# EAGLE design TH_itsy_bitsy_reference_board (EAGLE 9.5.2)
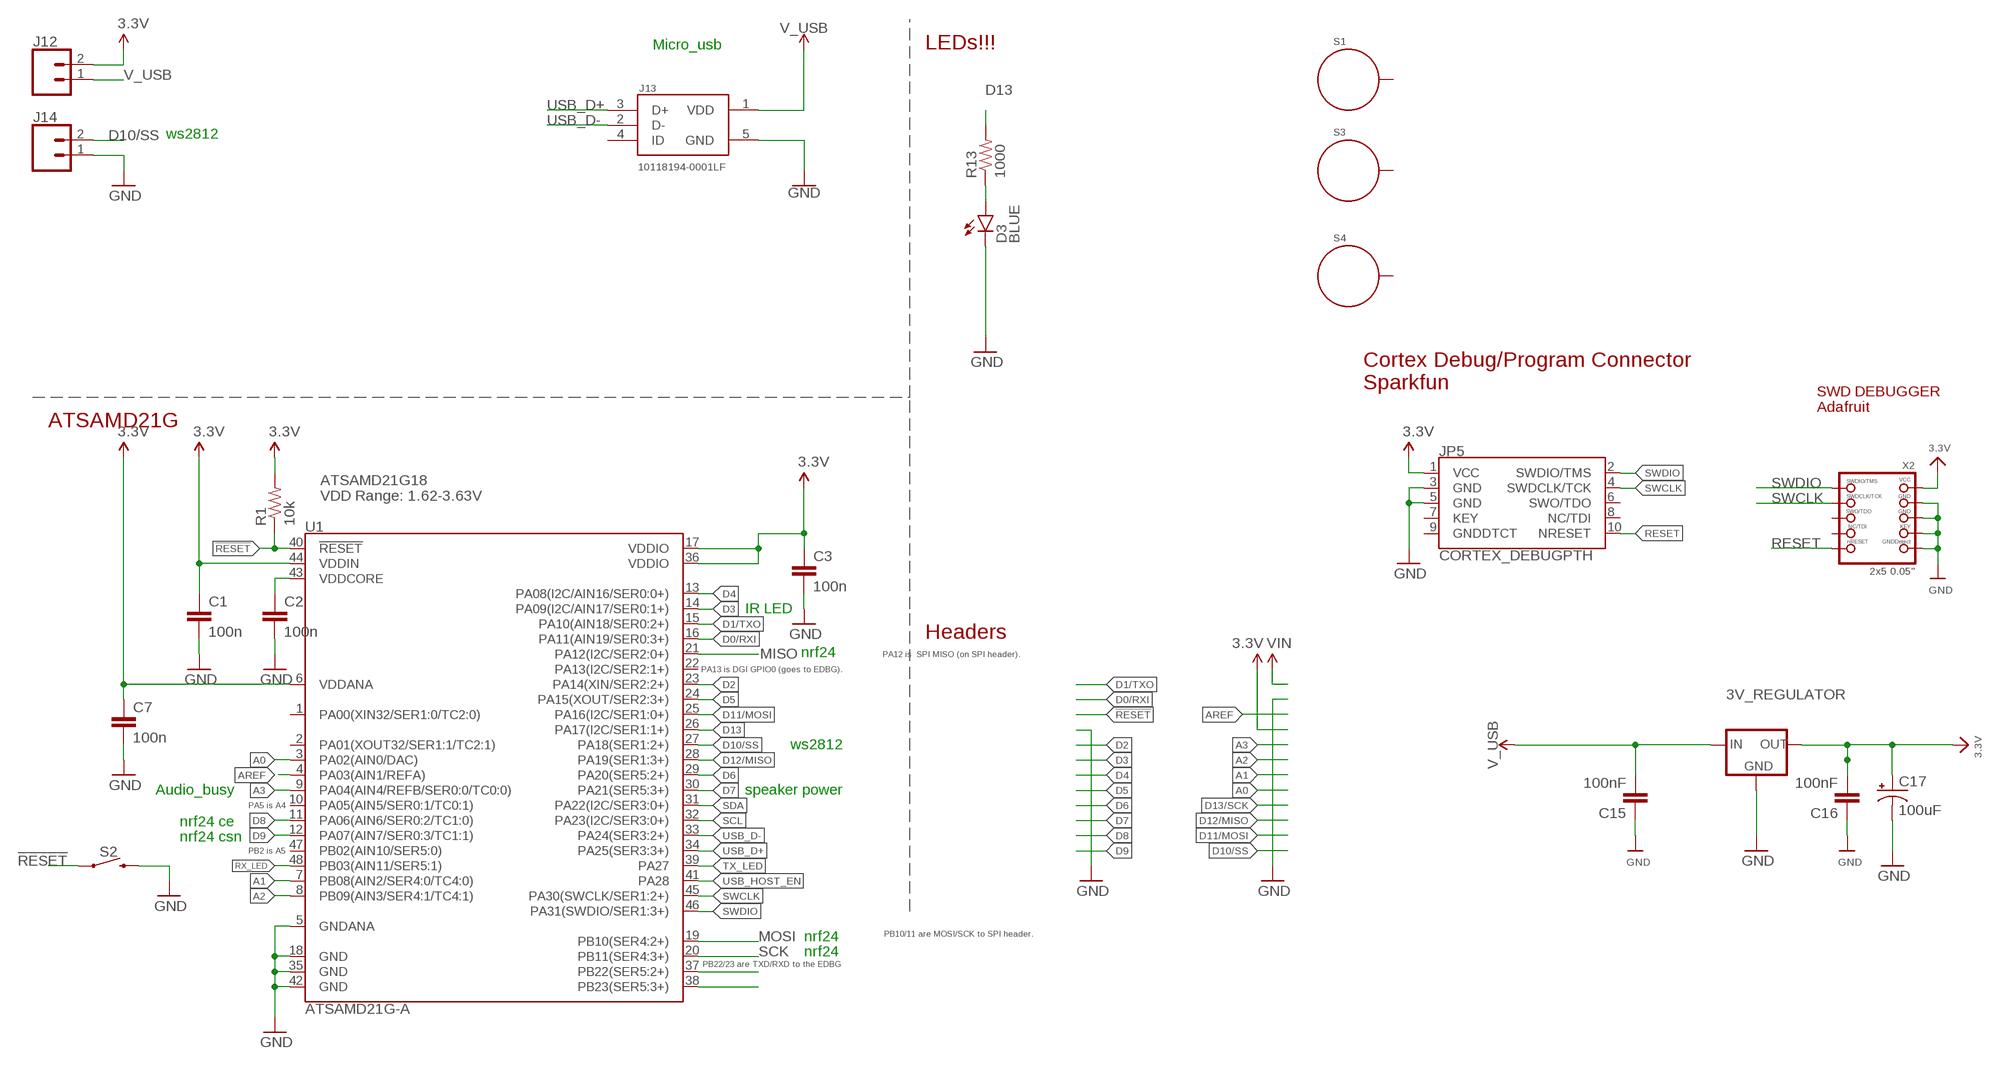
[diagram p0: schematic, sheet 1]

## Parts
3V_REGULATOR  LDL1117_5V_REG  [SOT223]
C1  100n  CAP0805  [0805]
C2  100n  CAP0805  [0805]
C3  100n  CAP0805  [0805]
C7  100n  CAP0805  [0805]
C15  100nF  10UF-0805-10V-10%  [0805]
C16  100nF  10UF-0805-10V-10%  [0805]
C17  100uF  100UF-POLAR-RADIAL-2.5MM-25V-20%  [CPOL-RADIAL-2.5MM-6.5MM]
D3  BLUE  LED-BLUE1206  [LED-1206]
J12  CONN_025MM  [SCREWTERMINAL-5MM-2]
J13  10118194-0001LF  [FRAMATOME_10118194-0001LF]
J14  CONN_025MM  [SCREWTERMINAL-5MM-2]
JP5  CORTEX_DEBUGPTH  [2X5-PTH-1.27MM]
R1  10k  RESISTOR0805-RES  [0805]
R13  1000  RESISTOR0805-RES  [0805]
S1  STANDOFF_ELECTRICAL144  [STANDOFF_ELECTRICAL_144MILL_NORMAL_SCREW]
S2  MOMENTARY-SWITCH-SPST-PTH-6.0MM-KIT  [TACTILE_SWITCH_PTH_6.0MM_KIT]
S3  STANDOFF_ELECTRICAL144  [STANDOFF_ELECTRICAL_144MILL_NORMAL_SCREW]
S4  STANDOFF_ELECTRICAL144  [STANDOFF_ELECTRICAL_144MILL_NORMAL_SCREW]
U1  ATSAMD21G-A  [TQFP-48]
X2  2x5 0.05"  JTAG-CORTEXBOXPOSTS  [2X05_1.27MM_BOX_POSTS]

## Nets
3.3V: 3V_REGULATOR.2(OUT) 3V_REGULATOR.4(OUT) C1.1 C3.1 C7.1 C16.2 C17.1(+) J12.2 JP5.1(VCC) R1.2 U1.6(VDDANA) U1.17(VDDIO) U1.36(VDDIO) U1.44(VDDIN) X2.1(VCC)
!RESET: R1.1 S2.1 U1.40(!RESET!)
A0: U1.3(PA02(AIN0/DAC))
A1: U1.7(PB08(AIN2/SER4:0/TC4:0))
A2: U1.8(PB09(AIN3/SER4:1/TC4:1))
A3: U1.9(PA04(AIN4/REFB/SER0:0/TC0:0))
AREF: U1.4(PA03(AIN1/REFA))
D0/RXI: U1.16(PA11(AIN19/SER0:3+))
D1/TXO: U1.15(PA10(AIN18/SER0:2+))
D2: U1.23(PA14(XIN/SER2:2+))
D3: U1.14(PA09(I2C/AIN17/SER0:1+))
D4: U1.13(PA08(I2C/AIN16/SER0:0+))
D5: U1.24(PA15(XOUT/SER2:3+))
D6: U1.29(PA20(SER5:2+))
D7: U1.30(PA21(SER5:3+))
D8: U1.11(PA06(AIN6/SER0:2/TC1:0))
D9: U1.12(PA07(AIN7/SER0:3/TC1:1))
D10/SS: J14.2 U1.27(PA18(SER1:2+))
D11/MOSI: U1.25(PA16(I2C/SER1:0+))
D12/MISO: U1.28(PA19(SER1:3+))
D13: R13.2 U1.26(PA17(I2C/SER1:1+))
GND: 3V_REGULATOR.1(GND) C1.2 C2.2 C3.2 C7.2 C15.1 C16.1 C17.2(-) D3.C J13.5(GND) J14.1 JP5.3(GND) JP5.5(GND) S2.3 U1.5(GNDANA) U1.18(GND) U1.35(GND) U1.42(GND) X2.3(GND) X2.5(GND) X2.7(KEY) X2.9(GNDDETECT)
INT1: U1.38(PB23(SER5:3+))
MISO: U1.21(PA12(I2C/SER2:0+))
MOSI: U1.19(PB10(SER4:2+))
N$2: U1.37(PB22(SER5:2+))
N$6: D3.A R13.1
RESET: JP5.10(NRESET) X2.10(NRESET)
RX_LED: U1.48(PB03(AIN11/SER5:1))
SCK: U1.20(PB11(SER4:3+))
SCL: U1.32(PA23(I2C/SER3:0+))
SDA: U1.31(PA22(I2C/SER3:0+))
SWCLK: JP5.4(SWDCLK/TCK) U1.45(PA30(SWCLK/SER1:2+)) X2.4(SWDCLK)
SWDIO: JP5.2(SWDIO/TMS) U1.46(PA31(SWDIO/SER1:3+)) X2.2(SWDIO)
TX_LED: U1.39(PA27)
USB_D+: J13.3(D+) U1.34(PA25(SER3:3+))
USB_D-: J13.2(D-) U1.33(PA24(SER3:2+))
USB_HOST_EN: U1.41(PA28)
V_USB: 3V_REGULATOR.3(IN) C15.2 J12.1 J13.1(VDD)
VDDCORE: C2.1 U1.43(VDDCORE)
Unconnected: J13.4(ID) JP5.6(SWO/TDO) JP5.7(KEY) JP5.8(NC/TDI) JP5.9(GNDDTCT) S1.P1 S3.P1 S4.P1 U1.1(PA00(XIN32/SER1:0/TC2:0)) U1.2(PA01(XOUT32/SER1:1/TC2:1)) U1.10(PA05(AIN5/SER0:1/TC0:1)) U1.22(PA13(I2C/SER2:1+)) U1.47(PB02(AIN10/SER5:0)) X2.6(SWO) X2.8(TDI)

## Notes on the sheet
- LEDs!!!
- Micro_usb
- ws2812
- Cortex Debug/Program Connector
  Sparkfun
- ATSAMD21G
- SWD DEBUGGER
  Adafruit
- ATSAMD21G18
  VDD Range: 1.62-3.63V
- IR LED
- Headers
- PA12 is  SPI MISO (on SPI header).
- nrf24
- PA13 is DGI GPIO0 (goes to EDBG).
- ws2812
- Audio_busy | speaker power
- PA5 is A4
- nrf24 ce
- nrf24 csn
- PB2 is A5
- PB10/11 are MOSI/SCK to SPI header.
- nrf24
- nrf24
- PB22/23 are TXD/RXD to the EDBG

## Library data of the parts
3V_REGULATOR = th_libraries_2:LDL1117_5V_REG: STMicroelectronics LDL1117S50R https://www.mouser.com/datasheet/2/389/ldl1117-1156241.pdf Mouser#: 511-LDL1117S50R bought 100 for $18 on ~2/3/18 5V, 1.2amp
C1-C3 C7 = SparkFun:CAP: Capacitor Standard 0603 ceramic capacitor, and 0.1" leaded capacitor.
C15 C16 = SparkFun-Capacitors:10UF: 10.0µF ceramic capacitors A capacitor is a passive two-terminal electrical component used to store electrical energy temporarily in an electric field.; PROD_ID: CAP-11330; VALUE: 10uF
C17 = SparkFun-Capacitors:100UF-POLAR: 100µF polarized capacitors A capacitor is a passive two-terminal electrical component used to store electrical energy temporarily in an electric field.; PROD_ID: CAP-08439
D3 = SparkFun-LED:LED-BLUE: Blue LEDs for production use Various blue LEDs stocked by SparkFun production 0603 - DIO-08575 Rebel - DIO-09553 1206 - DIO-09911; PROD_ID: DIO-09911
J12 J14 = SparkFun-Connectors:CONN_02: Multi connection point. Often used as Generic Header-pin footprint for 0.1 inch spaced/style header connections On any of the 0.1 inch spaced packages, you can populate with these: Break Away Headers - Straight <https://www.sparkfun.com/products/116> (PRT-00116) Break Away Male Headers - Right Angle <https://www.sparkfun.com/products/553> (PRT-00553) Female Headers <https://www.sparkfun.com/products/115> (PRT-00115) Break Away Headers - Machine Pin <https://www.sparkfun.com/products/117> (PRT-00117) Break Away Female Headers - Swiss Machine Pin <https://www.sparkfun.com/products/743> (PRT-00743) For SCREWTERMINALS and SPRING TERMINALS visit here: Screw Terimnals on SparkFun.com <https://www.sparkfun.com/search/results?term=Screw+Terminals> (5mm/3.5mm/2.54mm spacing) This device is also useful as a general connection point to wire up your design to another part of your project. Our various solder wires solder well into these plated through hole pads. Hook-Up Wire - Assortment (Stranded, 22 AWG) <https://www.sparkfun.com/products/11375> (PRT-11375) Hook-Up Wire - Assortment (Solid Core, 22 AWG) <https://www.sparkfun.com/products/11367> (PRT-11367) View the entire wire category on our website here <https://www.sparkfun.com/categories/141> Special notes: Molex polarized connector foot print use with: PRT-08233 with associated crimp pins and housings. 2.54_SCREWTERM for use with PRT-10571. 3.5mm Screw Terminal footprints for PRT-08084 5mm Screw Terminal footprints for use with PRT-08432; SF_SKU: PRT-08432
J13 = 10118194-0001LF:10118194-0001LF: Conn Micro USB Type B RCP 5 POS 0.65mm Solder RA SMD 5 Terminal 1 Port T/R; AVAILABILITY: Unavailable; DESCRIPTION: Micro Usb, 2.0 Type b, Rcpt, Smt; MF: Amphenol ICC; MP: 10118194-0001LF; PACKAGE: None; PRICE: None
JP5 = samd21-temp:CORTEX_DEBUG: Cortex Debug Connector Datasheet <http://infocenter.arm.com/help/topic/com.arm.doc.faqs/attached/13634/cortex_debug_connectors.pdf>
R1 = SparkFun:RESISTOR: Resistor Basic schematic elements and footprints for 0603, 1206, and PTH resistors.
R13 = SparkFun-Passives:RESISTOR: Resistor Basic schematic elements and footprints for 0603, 1206, and PTH resistors.
S1 S3 S4 = th_libraries:STANDOFF_ELECTRICAL: A standoff intended to be an electrically connected point. Pad size and stop size allow for a #8 Phillips pan screw head to make a solid connection to the board. Added 144mill drill hole that fits my normal wood screw
S2 = SparkFun-Switches:MOMENTARY-SWITCH-SPST: Momentary Switch (Pushbutton) - SPST Normally-open (NO) SPST momentary switches (buttons, pushbuttons). Variants PTH-12MM - 12mm square, through-hole Momentary Pushbutton Switch - 12mm Square <https://www.sparkfun.com/products/9190> (COM-09190) PTH-6.0MM, PTH-6.0MM-KIT - 6.0mm square, through-hole Mini Pushbutton Switch <https://www.sparkfun.com/products/97> (COM-00097) KIT package intended for soldering kit's - only one side of pads' copper is exposed. PTH-RIGHT-ANGLE-KIT - Right-angle, through-hole Right Angle Tactile Button <https://www.sparkfun.com/products/10791> - Used on SparkFun BigTime Watch Kit <https://www.sparkfun.com/products/11734> SMD-12MM - 12mm square, surface-mount Tactile Button - SMD (12mm) <https://www.sparkfun.com/products/12993> (COM-12993) Used on SparkFun PicoBoard <https://www.sparkfun.com/products/11888> SMD-4.5MM - 4.5mm Square Trackball Switch Used on SparkFun Blackberry Trackballer Breakout <https://www.sparkfun.com/products/13169> SMD-4.6MMX2.8MM - 4.60mm x 2.80mm, surface mount Used on SparkFun SAMD21 Mini Breakout <https://www.sparkfun.com/products/13664> SMD-5.2MM, SMD-5.2-REDUNDANT - 5.2mm square, surface-mount Mini Pushbutton Switch - SMD <https://www.sparkfun.com/products/8720> (COM-08720) Used on Arduino Pro Mini <https://www.sparkfun.com/products/11114> REDUNDANT package connects both switch circuits together SMD-6.0X3.5MM - 6.0 x 3.5mm, surface mount Momentary Reset Switch SMD <https://www.sparkfun.com/products/8229> (COM-08229) SMD-6.2MM-TALL - 6.2mm square, surface mount Tactile Button - SMD (6mm) <https://www.sparkfun.com/products/12992> Used on SparkFun Digital Sandbox <https://www.sparkfun.com/products/12651> SMD-RIGHT-ANGLE - Right-angle, surface mount Used on SparkFun Block for Intel® Edison - Arduino <https://www.sparkfun.com/products/13036>; PROD_ID: SWCH-08441; SF_SKU: COM-00097
U1 = samd21-temp:ATSAMD21G: Atmel SAMD21G SMART ARM-Based Microcontroller The Atmel ® | SMART ™ SAM D21 is a series of low-power microcontrollers using the 32-bit ARM ® Cortex ® -M0+ processor, and ranging from 32- to 64-pins with up to 256KB Flash and 32KB of SRAM. The SAM D21 devices operate at a maximum frequency of 48MHz and reach 2.46 CoreMark/MHz. They are designed for simple and intuitive migration with identical peripheral modules, hex compatible code, identical linear address map and pin compatible migration paths between all devices in the product series. All devices include intelligent and flexible peripherals, Atmel Event System for inter-peripheral signaling, and support for capacitive touch button, slider and wheel user interfaces.; PROD_ID: IC-13064
X2 = microbuilder:JTAG-CORTEX: Serial Wire (SW-DP) Connector Standard 0.05" 10-pin connector is for use with the Cortex M and Cortex A SWD (serial wire debugger) interface (SW-DP) Connectors 2x05_1.27MM_SMT - Inexpensive surface-mount header with bare pins, compatible with standard 10-pin SWD cables (4UCON: 16846) 2x05_1.27MM_BOX_NOPOSTS - Polarised surface-mount box (4UCON with caps: 19735, without caps: 15117 2x05_1.27MM_BOX_POSTS - Polarised surface-mount box with mounting holes (4UCON: 20317) Pinout: http://infocenter.arm.com/help/topic/com.arm.doc.faqs/attached/13634/cortex_debug_connectors.pdf http://www.keil.com/peripherals/coresight/connectors.asp

## Net classes
1 power: width 0.254 mm

## Board
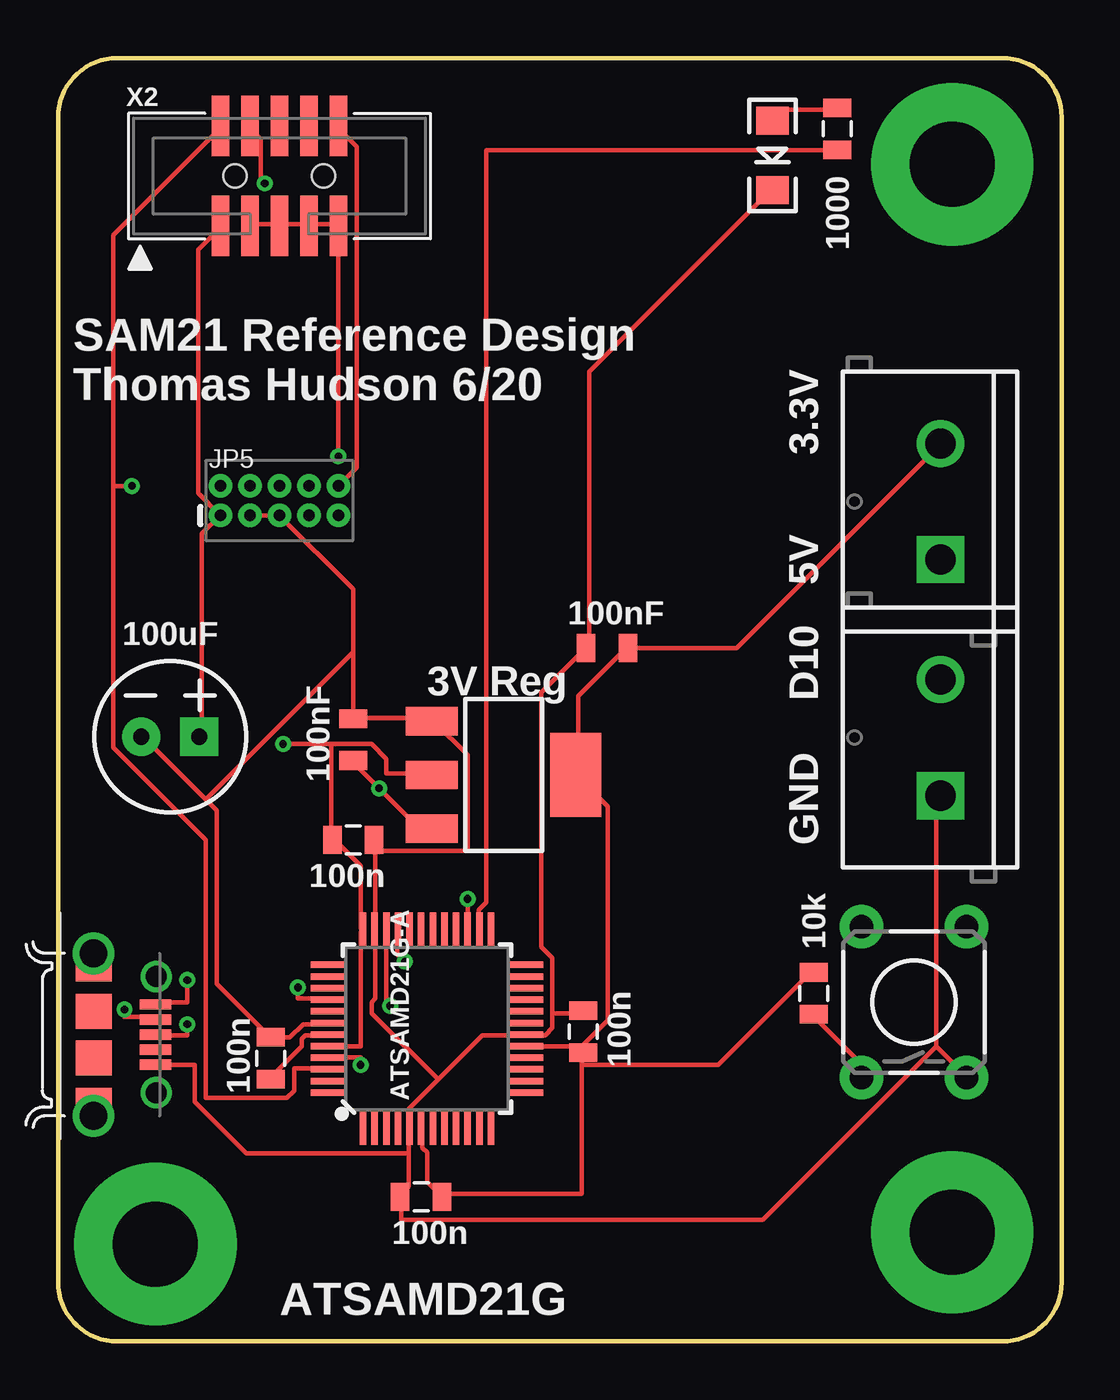
[diagram p1: board, top side]
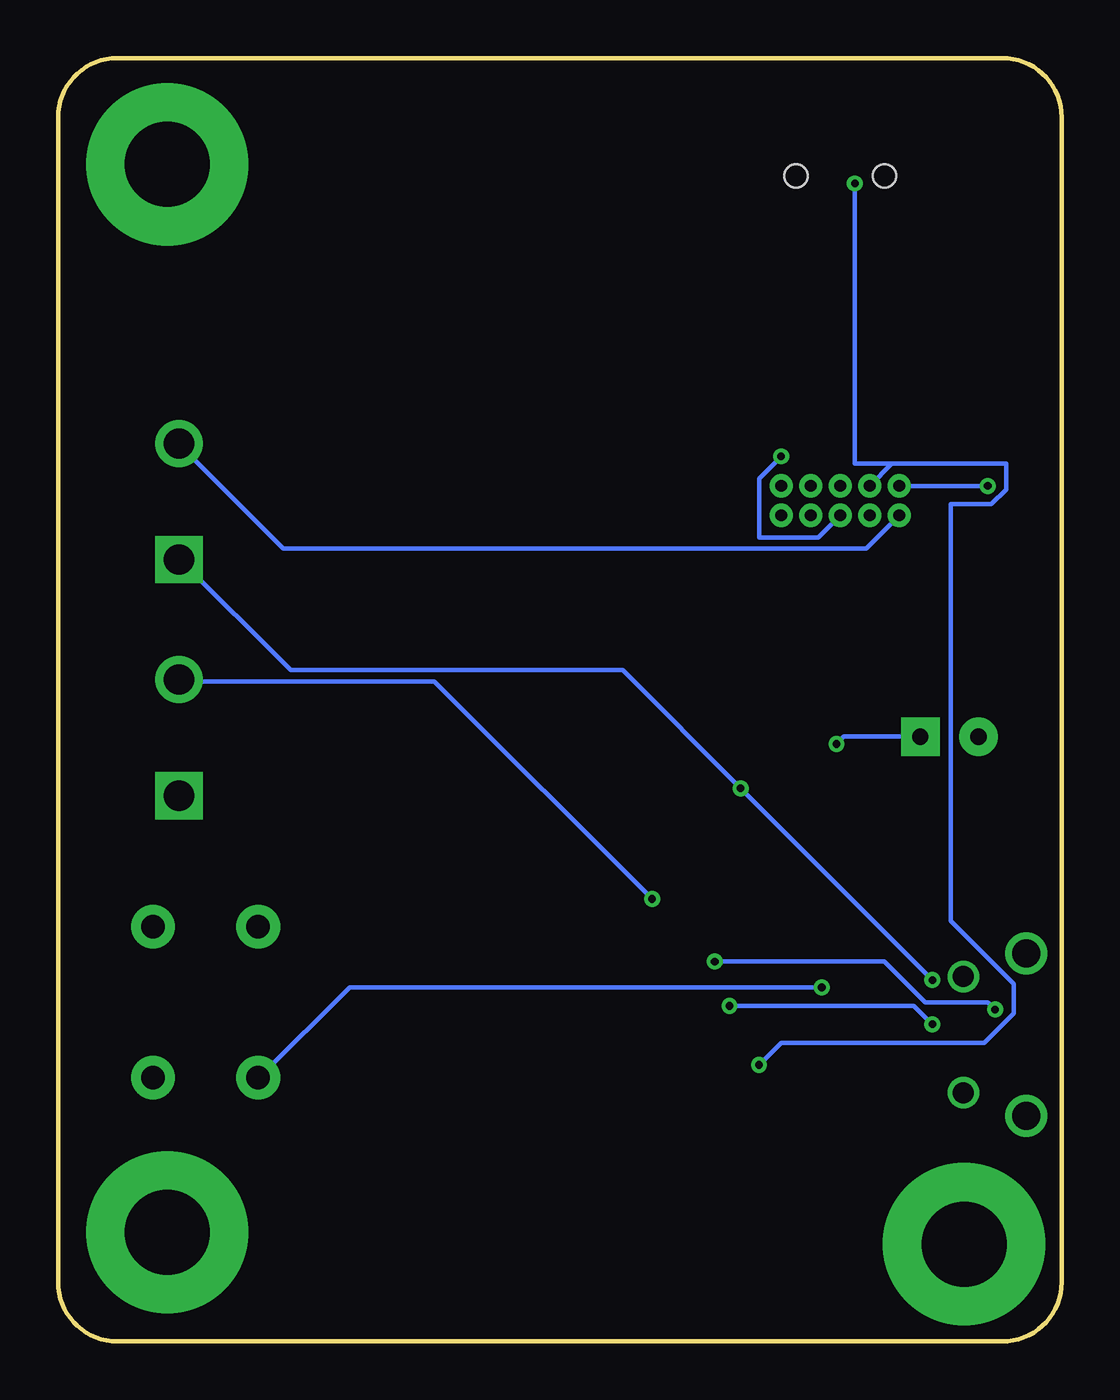
[diagram p2: board, bottom side, seen from below]

Size 43.18 x 55.25 mm. Coordinates in mm from the lower left corner, seen from the top.
Outline: 40.64,0 2.54,0 arc-90 0,2.54 0,52.7 arc-90 2.54,55.25 40.64,55.25 arc-90 43.18,52.7 43.18,2.54 arc-90 40.64,0
Copper layers (1*16): Top 0.0356mm / dielectric 1.5011mm / Bottom 0.0356mm
Design rules "LaenPCBOrder *": minimum track width 8mil, minimum drill 13mil, track to track 8mil, track to pad 8mil, pad to pad 6mil, via to via 8mil, smd to smd 6mil, copper to edge 15mil, drill to drill 6mil, minimum pad ring 7mil, minimum via ring 7mil, stop-mask expansion 3mil, vias tented up to drill 25mil, thermal gap 10mil

### Footprints (pad centres in the part's own frame; a part is rotated, then mirrored left to right if it is on the bottom)
SOT223 = smd 1.219 x 2.235: 1 -2.311,-3.099; 2 0,-3.099; 3 2.311,-3.099 | smd 3.6 x 2.2: 4 0,3.099
0805 = smd 0.8 x 1.2: 1 -0.9,0; 2 0.9,0
CPOL-RADIAL-2.5MM-6.5MM = drill 0.7 pad 1.651 square: 1 1.25,0 | drill 0.7 pad 1.651: 2 -1.25,0
LED-1206 = smd 1.2 x 1.4: A -1.5,0; C 1.5,0
SCREWTERMINAL-5MM-2 = drill 1.3 pad 2.032 square: 1 0,0 | drill 1.3 pad 2.032: 2 5,0
FRAMATOME_10118194-0001LF = smd 0.45 x 1.35: 1 -1.3,2.675; 2 -0.65,2.675; 3 0,2.675; 4 0.65,2.675; 5 1.3,2.675 | drill 0.9: P$6 -2.5,2.7; P$7 2.5,2.7 | drill 1.2: P$8 -3.5,0; P$9 3.5,0 | smd 1.5 x 1.55: P$10 -1,0; P$11 1,0; P$12 -3.05,0; P$13 3.05,0
2X5-PTH-1.27MM = drill 0.508 pad 1: 1 -2.54,-0.635; 2 -2.54,0.635; 3 -1.27,-0.635; 4 -1.27,0.635; 5 0,-0.635; 6 0,0.635; 7 1.27,-0.635; 8 1.27,0.635; 9 2.54,-0.635; 10 2.54,0.635
STANDOFF_ELECTRICAL_144MILL_NORMAL_SCREW = drill 3.658 pad 6.985: P1 0,0
TACTILE_SWITCH_PTH_6.0MM_KIT = drill 1.016 pad 1.88: 1 -3.251,2.261; 2 3.251,2.261; 3 -3.251,-2.261; 4 3.251,-2.261
TQFP-48 = smd 1.5 x 0.28: 1 -4.25,2.75; 2 -4.25,2.25; 3 -4.25,1.75; 4 -4.25,1.25; 5 -4.25,0.75; 6 -4.25,0.25; 7 -4.25,-0.25; 8 -4.25,-0.75; 9 -4.25,-1.25; 10 -4.25,-1.75; 11 -4.25,-2.25; 12 -4.25,-2.75; 25 4.25,-2.75; 26 4.25,-2.25; 27 4.25,-1.75; 28 4.25,-1.25; 29 4.25,-0.75; 30 4.25,-0.25; 31 4.25,0.25; 32 4.25,0.75; 33 4.25,1.25; 34 4.25,1.75; 35 4.25,2.25; 36 4.25,2.75 | smd 0.28 x 1.5: 13 -2.75,-4.25; 14 -2.25,-4.25; 15 -1.75,-4.25; 16 -1.25,-4.25; 17 -0.75,-4.25; 18 -0.25,-4.25; 19 0.25,-4.25; 20 0.75,-4.25; 21 1.25,-4.25; 22 1.75,-4.25; 23 2.25,-4.25; 24 2.75,-4.25; 37 2.75,4.25; 38 2.25,4.25; 39 1.75,4.25; 40 1.25,4.25; 41 0.75,4.25; 42 0.25,4.25; 43 -0.25,4.25; 44 -0.75,4.25; 45 -1.25,4.25; 46 -1.75,4.25; 47 -2.25,4.25; 48 -2.75,4.25
2X05_1.27MM_BOX_POSTS = smd 0.76 x 2.6: 1 -2.54,-2.15; 2 -2.54,2.15; 3 -1.27,-2.15; 4 -1.27,2.15; 5 0,-2.15; 6 0,2.15; 7 1.27,-2.15; 8 1.27,2.15; 9 2.54,-2.15; 10 2.54,2.15 | hole 1: -1.905,0; 1.905,0

### Placement (x,y rotation side)
3V_REGULATOR  19.18,24.38 270 top
C1  15.62,6.22 180 top
C2  9.14,12.19 90 top
C3  12.7,21.59 0 top
C7  22.61,13.34 90 top
C15  12.7,25.91 270 top
C16  23.62,29.84 0 top
C17  4.83,26.03 0 top
D3  30.73,51.05 270 top
J12  37.97,33.66 90 top
J13  1.52,13.21 270 top
J14  37.97,23.49 90 top
JP5  9.53,36.2 0 top
R1  32.51,14.99 90 top
R13  33.53,52.2 270 top
S1  38.48,4.7 0 top
S2  36.83,14.61 90 top
S3  38.48,50.67 0 top
S4  4.19,4.19 0 top
U1  15.88,13.46 90 top
X2  9.53,50.17 0 top

### Tracks (layer width: path | path; a pad name or v marks a point on that pad's centre or on a via)
3.3V  (via drill 0.33)
  Top 0.203: U1.44 11.75,12.7 13.02,12.7 13.02,17.62 U1.36 13.02,17.78 13.02,20.48 11.91,21.59 C3.1 11.75,21.59 11.75,25.72 | 11.75,25.72 13.49,25.72 14.13,25.08 14.13,24.45 16.03,24.45 3V_REGULATOR.2 | C17.1 6.19,26.03 6.19,34.77 JP5.1 6.03,36.51 6.03,46.99 6.99,47.94 X2.1 | v9.68,25.72 11.75,25.72 | 22.54,11.91 22.54,12.38 C7.1 | 22.54,11.91 22.54,6.35 16.67,6.35 C1.1 15.88,6.87 15.88,8.14 15.68,8.34 15.68,9.16 U1.6 | 22.54,11.91 28.42,11.91 32.38,15.88 R1.2 | 22.54,12.7 20.16,12.7 U1.17 | 22.54,12.7 22.54,12.54 C7.1 | J12.2 37.94,38.58 29.21,29.84 C16.2 24.45,29.84 22.38,27.78 22.38,24.45 3V_REGULATOR.4 22.38,24.29 23.65,23.02 23.65,13.81 22.54,12.7 | 22.54,12.7 C7.1
  Bottom 0.203: v9.68,25.72 9.37,26.03 C17.1 | JP5.1 8.41,34.13 33.5,34.13 37.94,38.58 J12.2
!RESET  (via drill 0.33)
  Top 0.203: R1.1 32.54,13.97 34.45,12.07 34.45,11.43 S2.1 | v10.32,15.24 10.32,14.76 11.59,14.76 U1.40
  Bottom 0.203: v10.32,15.24 30.64,15.24 34.45,11.43 S2.1
D10/SS  (via drill 0.33)
  Top 0.203: v17.62,19.05 17.62,17.78 U1.27
  Bottom 0.203: v17.62,19.05 26.99,28.42 37.94,28.42 J14.2
D13
  Top 0.203: R13.2 33.5,51.28 18.41,51.28 18.41,18.89 18.1,18.57 18.1,17.78 U1.26
GND  (via drill 0.33)
  Top 0.203: 6.35,23.34 3.65,26.03 C17.2 | 6.35,23.34 6.83,22.86 6.83,15.4 9.05,13.18 C2.2 9.98,13.09 10.54,13.66 11.57,13.66 U1.42 | 9.53,48.1 8.25,48.1 X2.3 | 9.53,48.1 10.8,48.1 | 9.53,48.1 X2.5 | 10.8,48.1 12.07,48.1 X2.9 v12.07,38.1 | 10.8,48.1 X2.7 | 13.65,21.11 13.65,17.78 U1.35 13.65,17.62 13.65,14.76 13.49,14.61 13.49,14.13 16.35,11.27 | 13.65,21.11 13.65,21.59 C3.2 13.65,21.11 | JP5.3 JP5.5 12.7,32.38 12.7,29.69 | 12.7,26.83 16.03,26.83 3V_REGULATOR.1 16.19,26.67 17.62,25.24 17.62,21.11 13.65,21.11 | 12.7,26.83 12.7,29.69 | 12.7,26.83 C15.1 | 12.7,29.69 6.35,23.34 | 37.78,12.7 39.05,11.43 S2.3 | 37.78,12.7 37.78,23.34 37.94,23.49 J14.1 | 15.08,8.1 15.08,9.21 U1.5 15.08,9.37 15.08,10 16.35,11.27 | 15.08,8.1 15.08,6.67 14.76,6.35 C1.2 14.76,6.19 14.76,5.24 30.32,5.24 37.78,12.7 | 15.08,8.1 8.1,8.1 5.87,10.32 5.87,11.91 4.29,11.91 J13.5 | 21.27,14.13 22.54,14.13 C7.2 | 21.27,14.13 21.27,13.49 20.96,13.18 20.16,13.18 U1.18 20,13.18 18.26,13.18 16.35,11.27 | 21.27,14.13 21.27,16.51 20.8,16.99 20.8,27.94 22.7,29.84 C16.1 22.86,29.84 22.86,41.75 30.64,49.53 D3.C
  Bottom 0.203: v12.07,38.1 13.02,37.15 13.02,34.61 10.48,34.61 JP5.5
N$6
  Top 0.203: R13.1 33.5,53.02 30.8,53.02 30.8,52.7 D3.A
RESET
  Top 0.203: JP5.10 12.86,37.62 12.86,51.44 12.07,52.23 X2.10
SWCLK  (via drill 0.33)
  Top 0.203: v13.02,11.91 13.02,12.22 11.75,12.22 U1.45 | v8.89,49.85 8.73,50.01 8.73,51.75 8.25,52.23 X2.4
  Bottom 0.203: v13.02,11.91 12.07,12.86 3.33,12.86 2.06,14.13 2.06,15.4 4.76,18.1 4.76,36.04 3.02,36.04 2.38,36.67 2.38,37.78 7.3,37.78 | JP5.4 7.3,37.78 | v8.89,49.85 8.89,37.78 7.3,37.78
SWDIO  (via drill 0.33)
  Top 0.203: 2.38,36.83 2.38,47.62 6.99,52.23 X2.2 | 2.38,36.83 2.38,25.56 6.35,21.59 6.35,10.48 9.84,10.48 10.16,10.8 10.16,11.75 11.59,11.75 U1.46 | 2.38,36.83 v3.17,36.83
  Bottom 0.203: v3.17,36.83 JP5.2
USB_D+  (via drill 0.33)
  Top 0.203: v5.56,13.65 5.56,13.18 4.29,13.18 J13.3 | v14.29,14.45 14.13,14.61 14.13,17.62 U1.34
  Bottom 0.203: v5.56,13.65 6.35,14.45 v14.29,14.45
USB_D-  (via drill 0.33)
  Top 0.203: v2.86,14.29 2.86,13.97 4.13,13.97 J13.2 | v14.92,16.35 14.61,16.67 14.61,17.62 U1.33
  Bottom 0.203: v2.86,14.29 3.17,14.61 5.87,14.61 7.62,16.35 v14.92,16.35
V_USB  (via drill 0.33)
  Top 0.203: C15.2 12.7,24.92 v13.81,23.81 15.4,22.23 16.03,22.23 3V_REGULATOR.3 | v5.56,15.56 5.56,14.61 4.29,14.61 J13.1
  Bottom 0.203: v5.56,15.56 v13.81,23.81 18.89,28.89 33.18,28.89 37.94,33.66 J12.1
VDDCORE
  Top 0.203: C2.1 9.21,11.43 10.48,12.7 10.48,13.02 10.64,13.18 11.59,13.18 U1.43

### Text on the board
tPlace: SAM21 Reference Design / Thomas Hudson 6/20 | 3.3V | 5V | D10 | 3V Reg | GND | ATSAMD21G